# Altium schematic sheet Motor Driver.SchDoc (part 3 of 3)
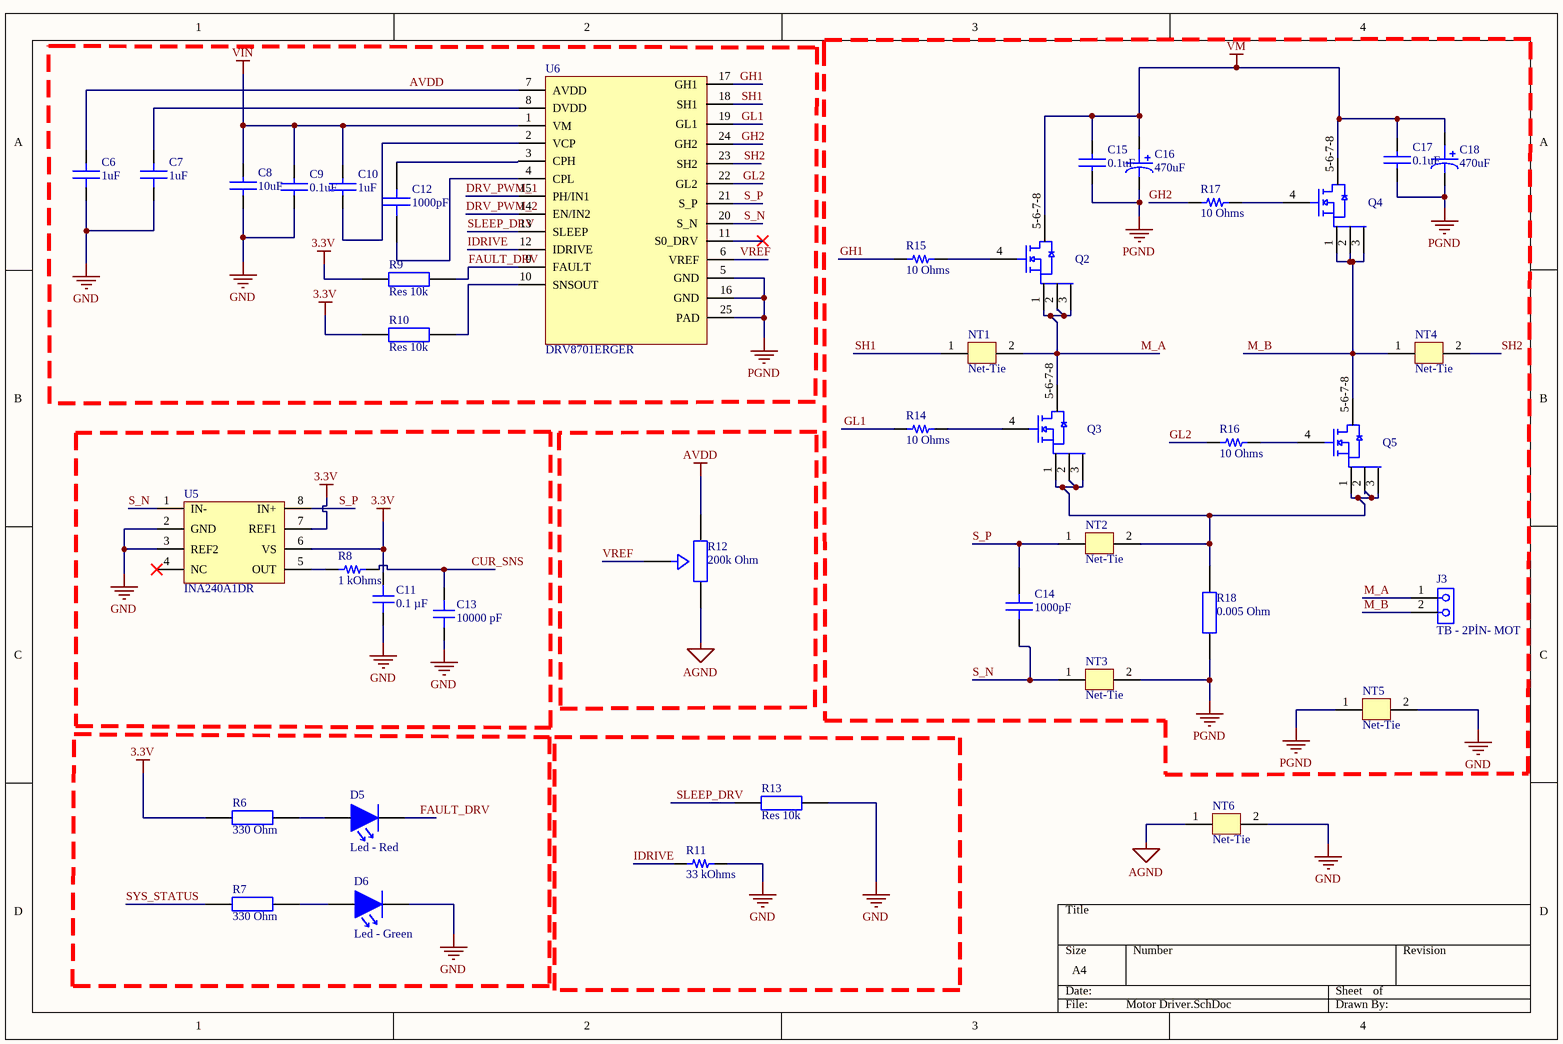
[diagram p2: Motor Driver.SchDoc]

## Library data of the parts (continued)
R9 R10 R13 = ERJ-2RKF1002X: Res Thick Film 0402 10K Ohm 1% 1/10W ±100ppm/°C Molded SMD Punched Carrier T/R; Manufacturer: Panasonic; Manufacturer Lifecycle Status: ACTIVE; Part Series: Precision Thick Film Chip Resistors; Max Power Dissipation: 100mW; Value: 10kΩ; Voltage Rating: 50V; Supplier: Farnell; Supplier Part Number: 2397284; Manufacturer Part Number: ERJ-2RKF1002X; RoHS: Compliant; Category: Chip SMD Resistors; Stock: 10700000; Pricing: 10000=0,005 (EUR); Case/Package: 0402; Case Code (Imperial): 0402; China RoHS: Non-Compliant; Composition: Thick Film; Contact Plating: Tin; Depth: 500µm; Features: Automotive AEC-Q200; Height: 350µm; Length: 1mm; Lifecycle Status: Production; Max Operating Temperature: 155°C; Military Standard: Not; Min Operating Temperature: -55°C; Mounting Technology: Surface Mount; Pins: 2; Number of Terminals: 2; Number of Terminations: 2; Packaging: Cut Tape; Power Dissipation: 100mW; Power Rating: 100mW; Radiation Hardening: No; REACH SVHC: Yes; Schedule B: 8533210045, 8533210045|8533210045|8533210045|8533210045|8533210045|8533210045|8533210045|8533210045|8533210045|8533210045|8533210045|8533210045|8533210045|8533210045|8533210045|8533210045|8533210045|8533210045|8533210045|8533210045|8533210045|8533210045|8533210045|85; Temperature Coefficient: 100ppm/°C; Termination: SMD/SMT; Tolerance: 1%; Voltage Rating (DC): 50V; Width: 500µm; Working Voltage: 50V; ComponentLink1URL: https://datasheet.octopart.com:443/ERJ-2RKF1002X-Panasonic-datasheet-82288794.pdf?src-supplier=Panasonic; ComponentLink1Description: https://datasheet.octopart.com:443/ERJ-2RKF1002X-Panasonic-datasheet-82288794.pdf?src-supplier=Panasonic; ComponentLink2URL: https://datasheet.octopart.com:443/ERJ-2RKF1002X-Panasonic-datasheet-13266541.pdf?src-supplier=RS+(Formerly+Allied+Electronics); ComponentLink2Description: https://datasheet.octopart.com:443/ERJ-2RKF1002X-Panasonic-datasheet-13266541.pdf?src-supplier=RS+(Formerly+Allied+Electronics); ComponentLink3URL: https://datasheet.octopart.com:443/ERJ-2RKF1002X-Panasonic-datasheet-10025800.pdf?src-supplier=Future+Electronics; ComponentLink3Description: https://datasheet.octopart.com:443/ERJ-2RKF1002X-Panasonic-datasheet-10025800.pdf?src-supplier=Future+Electronics; ComponentLink4URL: https://datasheet.octopart.com:443/ERJ-2RKF1002X-Panasonic-datasheet-8853621.pdf?src-supplier=Future+Electronics; ComponentLink4Description: https://datasheet.octopart.com:443/ERJ-2RKF1002X-Panasonic-datasheet-8853621.pdf?src-supplier=Future+Electronics; ComponentLink5URL: https://datasheet.octopart.com:443/ERJ-2RKF1002X-Panasonic-datasheet-5313456.pdf?src-supplier=Future+Electronics; ComponentLink5Description: https://datasheet.octopart.com:443/ERJ-2RKF1002X-Panasonic-datasheet-5313456.pdf?src-supplier=Future+Electronics; ComponentLink6URL: https://datasheet.octopart.com:443/ERJ-2RKF1002X-Panasonic-datasheet-48891056.pdf?src-supplier=Farnell; ComponentLink6Description: https://datasheet.octopart.com:443/ERJ-2RKF1002X-Panasonic-datasheet-48891056.pdf?src-supplier=Farnell; ComponentLink7URL: https://datasheet.octopart.com:443/ERJ-2RKF1002X-Panasonic-datasheet-136608610.pdf?src-supplier=Farnell; ComponentLink7Description: https://datasheet.octopart.com:443/ERJ-2RKF1002X-Panasonic-datasheet-136608610.pdf?src-supplier=Farnell; ComponentLink8URL: https://datasheet.octopart.com:443/ERJ-2RKF1002X-Panasonic-datasheet-154766169.pdf?src-supplier=Master+Electronics; ComponentLink8Description: https://datasheet.octopart.com:443/ERJ-2RKF1002X-Panasonic-datasheet-154766169.pdf?src-supplier=Master+Electronics; ComponentLink9URL: https://datasheet.octopart.com:443/ERJ2RKF1002X-Panasonic-datasheet-188592431.pdf?src-supplier=TME; ComponentLink9Description: https://datasheet.octopart.com:443/ERJ2RKF1002X-Panasonic-datasheet-188592431.pdf?src-supplier=TME; ComponentLink10URL: https://datasheet.octopart.com:443/ERJ2RKF1002X-Panasonic-datasheet-164353789.pdf?src-supplier=TME; ComponentLink10Description: https://datasheet.octopart.com:443/ERJ2RKF1002X-Panasonic-datasheet-164353789.pdf?src-supplier=TME; ComponentLink11URL: https://datasheet.octopart.com:443/ERJ2RKF1002X-Panasonic-datasheet-168681906.pdf?src-supplier=Newark; ComponentLink11Description: https://datasheet.octopart.com:443/ERJ2RKF1002X-Panasonic-datasheet-168681906.pdf?src-supplier=Newark; ComponentLink12URL: https://datasheet.octopart.com/ERJ-2RKF1002X-Panasonic-datasheet-78375410.pdf; ComponentLink12Description: https://datasheet.octopart.com/ERJ-2RKF1002X-Panasonic-datasheet-78375410.pdf; ComponentLink13URL: https://datasheet.octopart.com/Precision-Thick-Film-Chip-Resistors-Panasonic-datasheet-family-106.pdf; ComponentLink13Description: https://datasheet.octopart.com/Precision-Thick-Film-Chip-Resistors-Panasonic-datasheet-family-106.pdf; ComponentLink14URL: https://datasheet.octopart.com:443/ERJ-2RKF1002X-Panasonic-datasheet-11542829.pdf?src-supplier=Arrow+Electronics; ComponentLink14Description: https://datasheet.octopart.com:443/ERJ-2RKF1002X-Panasonic-datasheet-11542829.pdf?src-supplier=Arrow+Electronics; ComponentLink15URL: https://datasheet.octopart.com:443/ERJ-2RKF1002X-Panasonic-datasheet-7538305.pdf?src-supplier=Jameco; ComponentLink15Description: https://datasheet.octopart.com:443/ERJ-2RKF1002X-Panasonic-datasheet-7538305.pdf?src-supplier=Jameco; ComponentLink16URL: https://datasheet.octopart.com:443/ERJ-2RKF1002X-Panasonic-datasheet-118621.pdf?src-supplier=DigiKey; ComponentLink16Description: https://datasheet.octopart.com:443/ERJ-2RKF1002X-Panasonic-datasheet-118621.pdf?src-supplier=DigiKey; ComponentLink17URL: https://datasheet.octopart.com:443/ERJ-2RKF1002X-Panasonic-datasheet-41391857.pdf?src-supplier=Electro+Sonic; ComponentLink17Description: https://datasheet.octopart.com:443/ERJ-2RKF1002X-Panasonic-datasheet-41391857.pdf?src-supplier=Electro+Sonic
R11 = ERA-8ARW333V: RES SMD 33K OHM 0.05% 1/4W 1206; Manufacturer: Panasonic Electronic Components; Power (Watts): 0.25W, 1/4W; Temperature Coefficient: ±10ppm/°C; Part Number: ERA-8ARW333V; ComponentLink1Description: Datasheet; ComponentLink1URL: https://industrial.panasonic.com/cdbs/www-data/pdf/RDM0000/AOA0000C307.pdf; ComponentLink2Description: DigiKey Link; ComponentLink2URL: https://www.digikey.com/en/products/detail/panasonic-electronic-components/ERA-8ARW333V/5141147; Composition: Thin Film; Device Package: 1206 (3216 Metric); Features: Automotive AEC-Q200; Height - Seated (Max): 0.028" (0.70mm); LastUpdated: 9.02.2024 20:53:54; Lifecycle Status: Active; Minimum Order: 1; Number of Terminations: 2; Operating Temperature: -55°C ~ 155°C; Package / Case: 1206 (3216 Metric); Packaging: TapeAndReel; PartId: 40668; Part Status: Active; Price: 0.53; Ratings: AEC-Q200; Resistance: 33 kOhms; Series: ERA-8A; Size / Dimension: 0.126" L x 0.063" W (3.20mm x 1.60mm); Supplier 1: DigiKey; Supplier Part Number 1: P33KCTCT-ND; Supplier Device Package: 1206; Tolerance: ±0.05%; Value: 33 kOhms
R12 = 3352P-1-204LF: Res Cermet Trimmer 200K Ohm 20% 1/2W 1(Elec)/1(Mech)Turn (8.89 X 10.67 X 5.33mm) Pin Thru-Hole Bag; Manufacturer: Bourns; Lead Length: 4.75mm; Max Power Dissipation: 500mW; Number of Turns: 1; Value: 200kΩ; Temperature Coefficient: 100ppm/°C; Voltage Rating: 250V; Supplier: Avnet; Supplier Part Number: 3352P-1-204LF; Manufacturer Part Number: 3352P-1-204LF; RoHS: Compliant; Category: Variable Resistors and Potentiometers; Pricing: 500=1,54167, 1000=1,49838, 2000=1,45957, 4000=1,4282, 8000=1,4208 (USD); China RoHS: Non-Compliant; Color: Black; Composition: Cermet; Contact Plating: Tin; Diameter: 8.89mm; Height: 3.81mm; Lead Free: Lead Free; Length: 8.89mm; Lifecycle Status: Production; Max Operating Temperature: 125°C; Min Operating Temperature: -55°C; Mounting Technology: Through Hole; Number of Terminals: 3; Packaging: Bulk; Power Dissipation: 500mW; Power Rating: 500mW; REACH SVHC: Yes; Taper: Linear; Termination: Pin; Tolerance: 20%; Weight: 283.495231mg; Width: 8.89mm; Working Voltage: 250V; ComponentLink1URL: https://datasheet.octopart.com:443/3352P-1-204LF-Bourns-datasheet-182141424.pdf?src-supplier=IHS; ComponentLink1Description: https://datasheet.octopart.com:443/3352P-1-204LF-Bourns-datasheet-182141424.pdf?src-supplier=IHS; ComponentLink2URL: https://datasheet.octopart.com:443/3352P-1-204LF-Bourns-datasheet-154729576.pdf?src-supplier=Electro+Sonic; ComponentLink2Description: https://datasheet.octopart.com:443/3352P-1-204LF-Bourns-datasheet-154729576.pdf?src-supplier=Electro+Sonic; ComponentLink3URL: https://datasheet.octopart.com:443/3352P-1-204LF-Bourns-datasheet-25360171.pdf?src-supplier=Master+Electronics; ComponentLink3Description: https://datasheet.octopart.com:443/3352P-1-204LF-Bourns-datasheet-25360171.pdf?src-supplier=Master+Electronics; ComponentLink4URL: https://datasheet.octopart.com:443/3352P-1-204LF-Bourns-datasheet-3068.pdf?src-supplier=Mouser; ComponentLink4Description: https://datasheet.octopart.com:443/3352P-1-204LF-Bourns-datasheet-3068.pdf?src-supplier=Mouser; ComponentLink5URL: http://sigma.octopart.com:80/conflict_mineral_statement/Bourns-company-36.pdf?src-supplier=Compliance+Statements; ComponentLink5Description: http://sigma.octopart.com:80/conflict_mineral_statement/Bourns-company-36.pdf?src-supplier=Compliance+Statements
R14-R17 = RNCF0805DTE10R0: RES SMD 10 OHM 0.5% 1/4W 0805; Manufacturer: Stackpole Electronics Inc; Power (Watts): 0.25W, 1/4W; Temperature Coefficient: ±25ppm/°C; Part Number: RNCF0805DTE10R0; Value: 10 Ohms; ComponentLink1Description: Datasheet; ComponentLink1URL: https://www.seielect.com/catalog/sei-rncf.pdf; ComponentLink2Description: DigiKey Link; ComponentLink2URL: https://www.digikey.com/en/products/detail/stackpole-electronics-inc/RNCF0805DTE10R0/1708178; Composition: Thin Film; Device Package: 0805 (2012 Metric); Features: Automotive AEC-Q200; Height - Seated (Max): 0.026" (0.65mm); LastUpdated: 8.02.2024 21:02:37; Lifecycle Status: Active; Minimum Order: 1; Number of Terminations: 2; Operating Temperature: -55°C ~ 155°C; Package / Case: 0805 (2012 Metric); Packaging: TapeAndReel; PartId: 28018; Part Status: Active; Price: 0.01; Ratings: AEC-Q200; Resistance: 10 Ohms; Series: RNCF; Size / Dimension: 0.079" L x 0.049" W (2.00mm x 1.25mm); Supplier 1: DigiKey; Supplier Part Number 1: 738-RNCF0805DTE10R0CT-ND; Supplier Device Package: 0805; Tolerance: ±0.5%
R18 = KRL11050-C-R005-F-T1: Fixed Resistor, Metal Foil, 5W, 0.005ohm, 1% +/-Tol, 50ppm/Cel, Surface Mount, 4320; Manufacturer: Susumu; Value: 5mΩ; Temperature Coefficient: 50ppm/°C; Supplier: Mouser; Supplier Part Number: 754-KRL11050CR005FT1; Manufacturer Part Number: KRL11050-C-R005-F-T1; RoHS: Compliant; Category: Chip SMD Resistors; Stock: 172; Pricing: 1=3,22, 10=2,74, 50=2,74, 100=2,68, 1000=1,12, 10000=1,12 (USD); Case/Package: 4320; Case Code (Imperial): 4320; Composition: Metal Foil; Height: 500µm; Length: 11mm; Lifecycle Status: Production; Max Operating Temperature: 170°C; Max Power Dissipation: 5W; Max Thickness: 700µm; Min Operating Temperature: -55°C; Mounting Technology: Surface Mount; Number of Terminals: 2; Number of Terminations: 2; Packaging: Tape & Reel (TR); Power Dissipation: 5W; Power Rating: 5W; REACH SVHC: Yes; Termination: SMD/SMT; Tolerance: 1%; Width: 5mm; ComponentLink1URL: https://datasheet.octopart.com:443/KRL11050-C-R005-F-T1-Susumu-datasheet-12512222.pdf?src-supplier=IHS; ComponentLink1Description: https://datasheet.octopart.com:443/KRL11050-C-R005-F-T1-Susumu-datasheet-12512222.pdf?src-supplier=IHS
U5 = INA240A1DR: Op Amp Single Zero Drift Amplifier 5.5V 8-Pin SOIC T/R; Manufacturer: Texas Instruments; Manufacturer Lifecycle Status: ACTIVE; Bandwidth: 400kHz; Input Bias Current: 90µA; Input Offset Voltage (Vos): 5µV; Max Junction Temperature (Tj): 150°C; Min Supply Voltage: 2.7V; Nominal Supply Current: 1.8mA; Number of Channels: 1; Response Time: 9.6µs; Supplier: Mouser; Supplier Part Number: 595-INA240A1DR; Manufacturer Part Number: INA240A1DR; RoHS: Compliant; Category: Amplifiers - Op Amps, Buffer, Instrumentation; Stock: 3431; Pricing: 1=3,25, 10=2,43, 50=2,23, 100=2, 1000=1,78, 10000=1,72 (USD); Ambient Temperature Range High: 125°C; Case/Package: SOIC; Height: 1.75mm; Length: 4.9mm; Lifecycle Status: Production; Max Operating Temperature: 125°C; Max Supply Voltage: 5.5V; Min Operating Temperature: -40°C; Pins: 8; Schedule B: 8542390000; Thickness: 1.58mm; Width: 3.91mm; ComponentLink1URL: https://octopart.com:443/opatz8j6/c1?t=p-PgJrBFAr8xA6fUixjtJEPcygJhrUZgODNz6c-SVpAmd7h37absvwpdDSscf9_fUmiKMwmbz2Q6SpPSRPK0336Y4rwoY2Iitpj1kQqgpHpu2wssLHzjzgpYb186uSYTS6YEsI_uj73frUpw-DEzwRcxR0ogwW3lRb3qsMkRbUBukn47oyCbq071jaAY9MBIGZHLBKoenuXvNUOOPTiu_AwXT_jyV2VnXKSY5WodKwTBRxbLrd8wybhHTZ-no2vx-8xHMNuLRnvfPdC5L6Uakl6jnnSBLaOPQcPi__H6nHpuj7xnvw3vNJogrSGHRjAs9vvVE426YQ9TVA4noLKO4DGM7J69EemgYwMsMjUeoZ3UwrNR1hR4201P9ZR_y-TiABf4pg&src-supplier=Texas+Instruments; ComponentLink1Description: https://octopart.com:443/opatz8j6/c1?t=p-PgJrBFAr8xA6fUixjtJEPcygJhrUZgODNz6c-SVpAmd7h37absvwpdDSscf9_fUmiKMwmbz2Q6SpPSRPK0336Y4rwoY2Iitpj1kQqgpHpu2wssLHzjzgpYb186uSYTS6YEsI_uj73frUpw-DEzwRcxR0ogwW3lRb3qsMkRbUBukn47oyCbq071jaAY9MBIGZHLBKoenuXvNUOOPTiu_AwXT_jyV2VnXKSY5WodKwTBRxbLrd8wybhHTZ-no2vx-8xHMNuLRnvfPdC5L6Uakl6jnnSBLaOPQcPi__H6nHpuj7xnvw3vNJogrSGHRjAs9vvVE426YQ9TVA4noLKO4DGM7J69EemgYwMsMjUeoZ3UwrNR1hR4201P9ZR_y-TiABf4pg&src-supplier=Texas+Instruments; ComponentLink2URL: https://sigma.octopart.com:443/49249642/technical_drawing/Texas-Instruments-INA240A1DR.pdf?src-supplier=Texas+Instruments; ComponentLink2Description: https://sigma.octopart.com:443/49249642/technical_drawing/Texas-Instruments-INA240A1DR.pdf?src-supplier=Texas+Instruments; ComponentLink3URL: https://datasheet.octopart.com:443/INA240A1DR-Texas-Instruments-datasheet-147851276.pdf?src-supplier=SHENGYU+ELECTRONICS; ComponentLink3Description: https://datasheet.octopart.com:443/INA240A1DR-Texas-Instruments-datasheet-147851276.pdf?src-supplier=SHENGYU+ELECTRONICS; ComponentLink4URL: https://datasheet.octopart.com:443/INA240A1DR-Texas-Instruments-datasheet-140571434.pdf?src-supplier=Arrow.cn; ComponentLink4Description: https://datasheet.octopart.com:443/INA240A1DR-Texas-Instruments-datasheet-140571434.pdf?src-supplier=Arrow.cn; ComponentLink5URL: http://sigma.octopart.com:80/reach_statement/Texas-Instruments-company-64.pdf?src-supplier=Compliance+Statements; ComponentLink5Description: http://sigma.octopart.com:80/reach_statement/Texas-Instruments-company-64.pdf?src-supplier=Compliance+Statements; ComponentLink6URL: http://sigma.octopart.com:80/conflict_mineral_statement/Texas-Instruments-company-63.pdf?src-supplier=Compliance+Statements; ComponentLink6Description: http://sigma.octopart.com:80/conflict_mineral_statement/Texas-Instruments-company-63.pdf?src-supplier=Compliance+Statements
U6 = DRV8701ERGER: IC MOTOR DRIVER 0V-5.5V 24VQFN / DRV8701 Brushed DC Motor Full-Bridge Gate Driver; Manufacturer: Texas Instruments; Manufacturer Lifecycle Status: ACTIVE; Interface: Parallel; Max Junction Temperature (Tj): 150°C; Max Supply Voltage: 45V; Min Supply Voltage: 5.9V; Nominal Supply Current: 6mA; Number of Outputs: 1; Supplier: Mouser; Supplier Part Number: 595-DRV8701ERGER; Manufacturer Part Number: DRV8701ERGER; RoHS: Compliant; Category: Motor Drivers; Stock: 27951; Pricing: 1=2,5, 10=1,86, 50=1,7, 100=1,53, 1000=1,35, 10000=1,28 (USD); Ambient Temperature Range High: 125°C; Case/Package: VQFN; Height: 1mm; Lead Free: Lead Free; Length: 4mm; Lifecycle Status: Production; Max Operating Temperature: 125°C; Min Operating Temperature: -40°C; Motor Type: Brushed; Mounting Technology: Surface Mount; Pins: 24; Packaging: Tape & Reel (TR); Schedule B: 8542390000, 8542390000|8542390000|8542390000|8542390000|8542390000; Thickness: 880µm; Width: 4mm; ComponentLink1URL: https://octopart.com:443/opatz8j6/c1?t=ehAvkSXBWFOcNy9gonZ63OFc4bGZy_2bC1yLMMZIE2dHvvmlfP0jhbvnU8Lmxs1os63rxVSLRkGfXEyoXZwuI3xa-A0nKTkUdkof3FcH7DoixXm7eccnxPjwKUbon8TyokAeKmHARyr0YTEYu2yTSqZqwhN4T5qjFzB3LmGwYiWcRp1IAWblEDvyTzgm9MlCjGAc7pFp8-BPtV_aZqMkSCa5FXPY0wjPPEvaFqR9bR4LURryWP85fi2f2SdWa8VnjSuqI1QvioQUQNJM9wxRjQVNXkbLhzpyfd5lk-jkTzwJSa7BcbDh8f7bv5xnoKYdxg9tK1lmzh9ymQi7DFEKtgHp_jmJbFmHhosrZ3PDnB4z80oZFuFmV3wgX_LxNwYzUNjWA44&src-supplier=Texas+Instruments; ComponentLink1Description: https://octopart.com:443/opatz8j6/c1?t=ehAvkSXBWFOcNy9gonZ63OFc4bGZy_2bC1yLMMZIE2dHvvmlfP0jhbvnU8Lmxs1os63rxVSLRkGfXEyoXZwuI3xa-A0nKTkUdkof3FcH7DoixXm7eccnxPjwKUbon8TyokAeKmHARyr0YTEYu2yTSqZqwhN4T5qjFzB3LmGwYiWcRp1IAWblEDvyTzgm9MlCjGAc7pFp8-BPtV_aZqMkSCa5FXPY0wjPPEvaFqR9bR4LURryWP85fi2f2SdWa8VnjSuqI1QvioQUQNJM9wxRjQVNXkbLhzpyfd5lk-jkTzwJSa7BcbDh8f7bv5xnoKYdxg9tK1lmzh9ymQi7DFEKtgHp_jmJbFmHhosrZ3PDnB4z80oZFuFmV3wgX_LxNwYzUNjWA44&src-supplier=Texas+Instruments; ComponentLink2URL: https://sigma.octopart.com:443/102096900/technical_drawing/Texas-Instruments-DRV8701ERGER.pdf?src-supplier=Texas+Instruments; ComponentLink2Description: https://sigma.octopart.com:443/102096900/technical_drawing/Texas-Instruments-DRV8701ERGER.pdf?src-supplier=Texas+Instruments; ComponentLink3URL: https://sigma.octopart.com:443/49249793/technical_drawing/Texas-Instruments-DRV8701ERGER.pdf?src-supplier=Texas+Instruments; ComponentLink3Description: https://sigma.octopart.com:443/49249793/technical_drawing/Texas-Instruments-DRV8701ERGER.pdf?src-supplier=Texas+Instruments; ComponentLink4URL: https://datasheet.octopart.com:443/DRV8701ERGER-Texas-Instruments-datasheet-149152576.pdf?src-supplier=SHENGYU+ELECTRONICS; ComponentLink4Description: https://datasheet.octopart.com:443/DRV8701ERGER-Texas-Instruments-datasheet-149152576.pdf?src-supplier=SHENGYU+ELECTRONICS; ComponentLink5URL: https://datasheet.octopart.com:443/DRV8701ERGER-Texas-Instruments-datasheet-41215435.pdf?src-supplier=Future+Electronics; ComponentLink5Description: https://datasheet.octopart.com:443/DRV8701ERGER-Texas-Instruments-datasheet-41215435.pdf?src-supplier=Future+Electronics; ComponentLink6URL: https://datasheet.octopart.com:443/DRV8701ERGER-Texas-Instruments-datasheet-161906130.pdf?src-supplier=LCSC; ComponentLink6Description: https://datasheet.octopart.com:443/DRV8701ERGER-Texas-Instruments-datasheet-161906130.pdf?src-supplier=LCSC; ComponentLink7URL: https://datasheet.octopart.com:443/DRV8701ERGER-Texas-Instruments-datasheet-140571382.pdf?src-supplier=Arrow.cn; ComponentLink7Description: https://datasheet.octopart.com:443/DRV8701ERGER-Texas-Instruments-datasheet-140571382.pdf?src-supplier=Arrow.cn; ComponentLink8URL: http://sigma.octopart.com:80/reach_statement/Texas-Instruments-company-64.pdf?src-supplier=Compliance+Statements; ComponentLink8Description: http://sigma.octopart.com:80/reach_statement/Texas-Instruments-company-64.pdf?src-supplier=Compliance+Statements; ComponentLink9URL: http://sigma.octopart.com:80/conflict_mineral_statement/Texas-Instruments-company-63.pdf?src-supplier=Compliance+Statements; ComponentLink9Description: http://sigma.octopart.com:80/conflict_mineral_statement/Texas-Instruments-company-63.pdf?src-supplier=Compliance+Statements